# EAGLE design plc-bridge (EAGLE 9.6.2)
Powerline Bridge: mains-powered HomePlug Green PHY (QCA7005) ↔ 10/100 Ethernet bridge: PLC Stamp mini 2 + ESP32 SPI host + WIZ850io
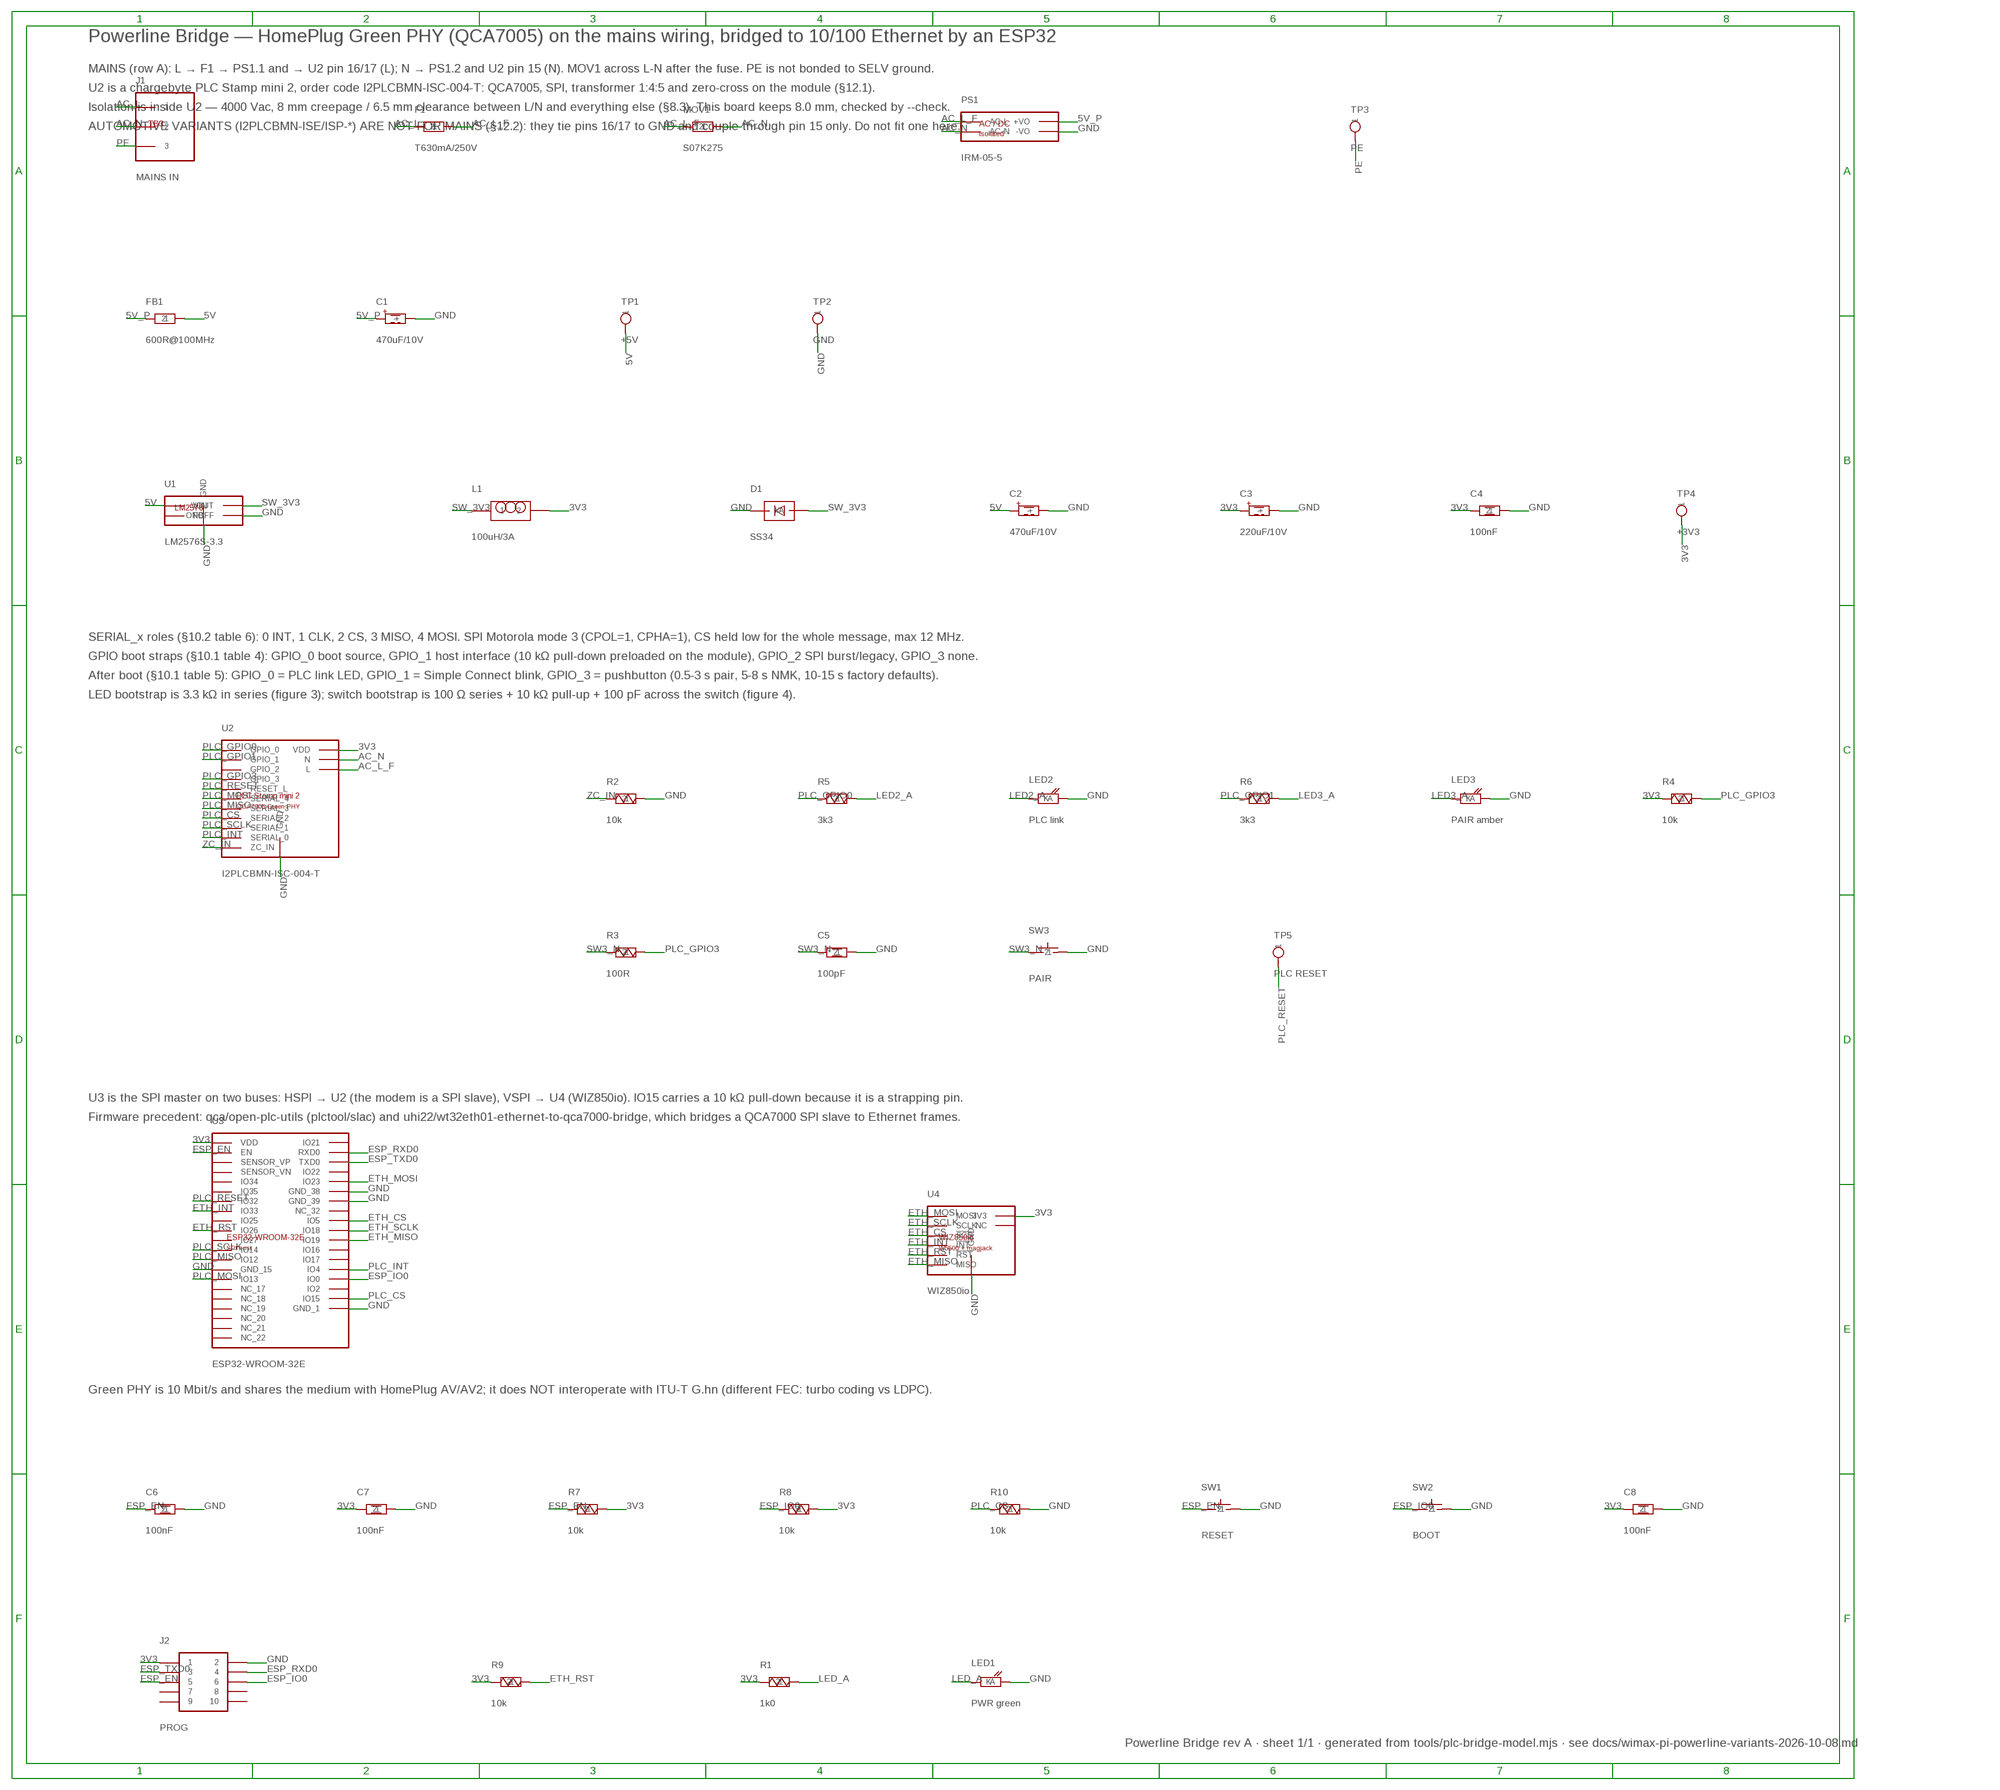
[diagram p0: schematic, sheet 1]

## Parts
C1  470uF/10V  CPOL-EU  [CP-D10-P5]
C2  470uF/10V  CPOL-EU  [CP-D10-P5]
C3  220uF/10V  CPOL-EU  [CP-D10-P5]
C4  100nF  C-0603  [C0603]
C5  100pF  C-EU  [C-5.08]
C6  100nF  C-0603  [C0603]
C7  100nF  C-0603  [C0603]
C8  100nF  C-0603  [C0603]
D1  SS34  DIODE-SCH  [DO41]
F1  T630mA/250V  FUSE  [FUSE-RADIAL]
FB1  600R@100MHz  FERRITE  [FB-7.62]
J1  MAINS IN  TERM-3  [CUI_TB003]
J2  PROG  HDR-2X5  [HDR-2X5]
L1  100uH/3A  L-RADIAL  [LRAD12]
LED1  PWR green  LED  [LED-5MM]
LED2  PLC link  LED  [LED-5MM]
LED3  PAIR amber  LED  [LED-5MM]
MOV1  S07K275  MOV  [MOV07]
PS1  IRM-05-5  ACDC-5V  [IRM055]
R1  1k0  R-EU  [R-7.62]
R2  10k  R-EU  [R-7.62]
R3  100R  R-EU  [R-7.62]
R4  10k  R-EU  [R-7.62]
R5  3k3  R-EU  [R-7.62]
R6  3k3  R-EU  [R-7.62]
R7  10k  R-EU  [R-7.62]
R8  10k  R-EU  [R-7.62]
R9  10k  R-EU  [R-7.62]
R10  10k  R-EU  [R-7.62]
SW1  RESET  SW-PUSH  [SW-TACT-6MM]
SW2  BOOT  SW-PUSH  [SW-TACT-6MM]
SW3  PAIR  SW-PUSH  [SW-TACT-6MM]
TP1  +5V  TP  [TP]
TP2  GND  TP  [TP]
TP3  PE  TP  [TP]
TP4  +3V3  TP  [TP]
TP5  PLC RESET  TP  [TP]
U1  LM2576S-3.3  BUCK-3V3  [LM2576S]
U2  I2PLCBMN-ISC-004-T  PLC-STAMP-MINI-2  [PLCSTAMP]
U3  ESP32-WROOM-32E  [ESP32WROOM]
U4  WIZ850io  WIZ850IO  [WIZ850IO]

## Nets
3V3 [power]: C3.+ C4.1 C7.1 C8.1 J2.1 L1.2 R1.1 R4.1 R7.2 R8.2 R9.1 TP4.1 U2.12(VDD) U3.2(VDD) U4.8(3V3) U4.9(3V3)
5V [power]: C2.+ FB1.2 TP1.1 U1.1(VIN)
5V_P [power]: C1.+ FB1.1 PS1.4(+VO)
AC_L [mains]: F1.1 J1.1
AC_L_F [mains]: F1.2 MOV1.1 PS1.1(AC-L) U2.16(L) U2.17(L)
AC_N [mains]: J1.2 MOV1.2 PS1.2(AC-N) U2.15(N)
ESP_EN: C6.1 J2.5 R7.1 SW1.1 U3.3(EN)
ESP_IO0: J2.6 R8.1 SW2.1 U3.25(IO0)
ESP_RXD0: J2.4 U3.34(RXD0)
ESP_TXD0: J2.3 U3.35(TXD0)
ETH_CS: U3.29(IO5) U4.5(!SCS)
ETH_INT: U3.9(IO33) U4.6(!INT)
ETH_MISO: U3.31(IO19) U4.12(MISO)
ETH_MOSI: U3.37(IO23) U4.3(MOSI)
ETH_RST: R9.2 U3.11(IO26) U4.11(!RST)
ETH_SCLK: U3.30(IO18) U4.4(SCLK)
GND [power]: C1.- C2.- C3.- C4.2 C5.2 C6.2 C7.2 C8.2 D1.A J2.2 LED1.2(K) LED2.2(K) LED3.2(K) PS1.3(-VO) R2.2 R10.2 SW1.2 SW2.2 SW3.2 TP2.1 U1.3(GND) U1.3_2(GND) U1.5(ONOFF) U1.P7(GND) U1.P8(GND) U1.P9(GND) U1.P10(GND) U2.11(GND) U2.18(GND) U2.19(GND) U2.20(GND) U2.21(GND) U2.22(GND) U2.23(GND) U2.24(GND) U2.25(GND) U3.1(GND_1) U3.15(GND_15) U3.38(GND_38) U3.39(GND_39) U4.1(GND) U4.2(GND) U4.7(GND)
LED2_A: LED2.1(A) R5.2
LED3_A: LED3.1(A) R6.2
LED_A: LED1.1(A) R1.2
PE [mains]: J1.3 TP3.1
PLC_CS: R10.1 U2.8(SERIAL_2) U3.23(IO15)
PLC_GPIO0: R5.1 U2.1(GPIO_0)
PLC_GPIO1: R6.1 U2.2(GPIO_1)
PLC_GPIO3: R3.2 R4.2 U2.4(GPIO_3)
PLC_INT: U2.10(SERIAL_0) U3.26(IO4)
PLC_MISO: U2.7(SERIAL_3) U3.14(IO12)
PLC_MOSI: U2.6(SERIAL_4) U3.16(IO13)
PLC_RESET: TP5.1 U2.5(RESET_L) U3.8(IO32)
PLC_SCLK: U2.9(SERIAL_1) U3.13(IO14)
SW3_N: C5.1 R3.1 SW3.1
SW_3V3 [power]: D1.K L1.1 U1.2(VOUT)
ZC_IN: R2.1 U2.13(ZC_IN)
Unconnected: J2.7 J2.8 J2.9 J2.10 U1.4(FB) U2.3(GPIO_2) U3.4(SENSOR_VP) U3.5(SENSOR_VN) U3.6(IO34) U3.7(IO35) U3.10(IO25) U3.12(IO27) U3.17(NC_17) U3.18(NC_18) U3.19(NC_19) U3.20(NC_20) U3.21(NC_21) U3.22(NC_22) U3.24(IO2) U3.27(IO16) U3.28(IO17) U3.32(NC_32) U3.33(IO21) U3.36(IO22) U4.10(NC)

## Notes on the sheet
- Powerline Bridge — HomePlug Green PHY (QCA7005) on the mains wiring, bridged to 10/100 Ethernet by an ESP32
- MAINS (row A): L → F1 → PS1.1 and → U2 pin 16/17 (L); N → PS1.2 and U2 pin 15 (N). MOV1 across L-N after the fuse. PE is not bonded to SELV ground.
- U2 is a chargebyte PLC Stamp mini 2, order code I2PLCBMN-ISC-004-T: QCA7005, SPI, transformer 1:4:5 and zero-cross on the module (§12.1).
- Isolation is inside U2 — 4000 Vac, 8 mm creepage / 6.5 mm clearance between L/N and everything else (§8.3). This board keeps 8.0 mm, checked by --check.
- AUTOMOTIVE VARIANTS (I2PLCBMN-ISE/ISP-*) ARE NOT FOR MAINS (§12.2): they tie pins 16/17 to GND and couple through pin 15 only. Do not fit one here.
- SERIAL_x roles (§10.2 table 6): 0 INT, 1 CLK, 2 CS, 3 MISO, 4 MOSI. SPI Motorola mode 3 (CPOL=1, CPHA=1), CS held low for the whole message, max 12 MHz.
- GPIO boot straps (§10.1 table 4): GPIO_0 boot source, GPIO_1 host interface (10 kΩ pull-down preloaded on the module), GPIO_2 SPI burst/legacy, GPIO_3 none.
- After boot (§10.1 table 5): GPIO_0 = PLC link LED, GPIO_1 = Simple Connect blink, GPIO_3 = pushbutton (0.5-3 s pair, 5-8 s NMK, 10-15 s factory defaults).
- LED bootstrap is 3.3 kΩ in series (figure 3); switch bootstrap is 100 Ω series + 10 kΩ pull-up + 100 pF across the switch (figure 4).
- U3 is the SPI master on two buses: HSPI → U2 (the modem is a SPI slave), VSPI → U4 (WIZ850io). IO15 carries a 10 kΩ pull-down because it is a strapping pin.
- Firmware precedent: qca/open-plc-utils (plctool/slac) and uhi22/wt32eth01-ethernet-to-qca7000-bridge, which bridges a QCA7000 SPI slave to Ethernet frames.
- Green PHY is 10 Mbit/s and shares the medium with HomePlug AV/AV2; it does NOT interoperate with ITU-T G.hn (different FEC: turbo coding vs LDPC).
- Powerline Bridge rev A · sheet 1/1 · generated from tools/plc-bridge-model.mjs · see docs/wimax-pi-powerline-variants-2026-10-08.md

## Library data of the parts
C1-C3 = plc-bridge:CPOL-EU
C4 C6-C8 = plc-bridge:C-0603
C5 = plc-bridge:C-EU
D1 = plc-bridge:DIODE-SCH
F1 = plc-bridge:FUSE
FB1 = plc-bridge:FERRITE
J1 = plc-bridge:TERM-3
J2 = plc-bridge:HDR-2X5
L1 = plc-bridge:L-RADIAL
LED1-LED3 = plc-bridge:LED
MOV1 = plc-bridge:MOV
PS1 = plc-bridge:ACDC-5V
R1-R10 = plc-bridge:R-EU
SW1-SW3 = plc-bridge:SW-PUSH
TP1-TP5 = plc-bridge:TP
U1 = plc-bridge:BUCK-3V3
U2 = plc-bridge:PLC-STAMP-MINI-2
U3 = plc-bridge:ESP32-WROOM-32E
U4 = plc-bridge:WIZ850IO

## Net classes
0 default: width 0.305 mm
1 mains: width 2.5 mm, clearance 8 mm to class 0, clearance 8 mm, clearance 8 mm to class 2
2 power: width 1 mm, clearance 0.5 mm to class 0, clearance 0.6 mm

## Board
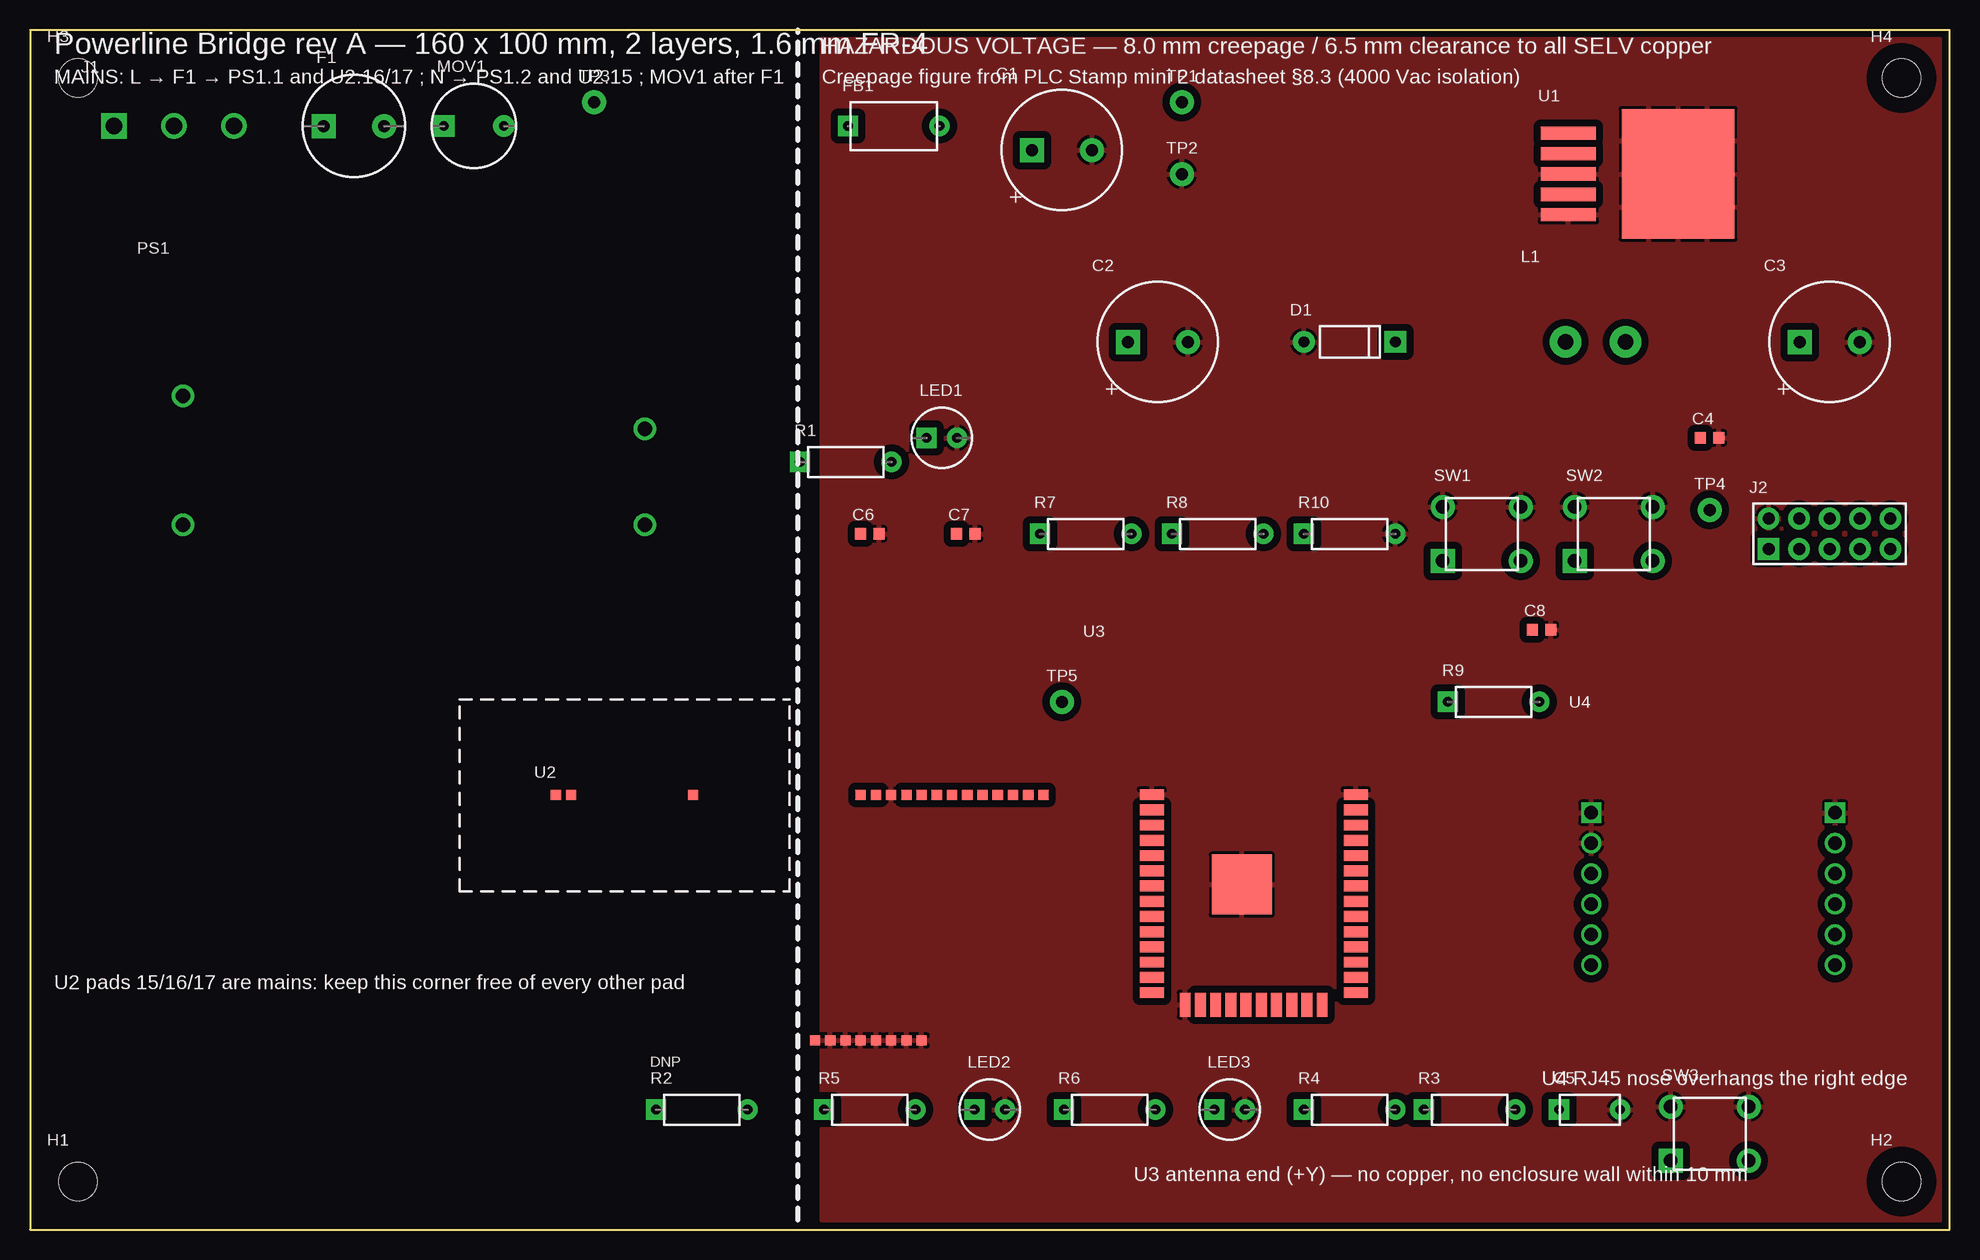
[diagram p1: board, top side]
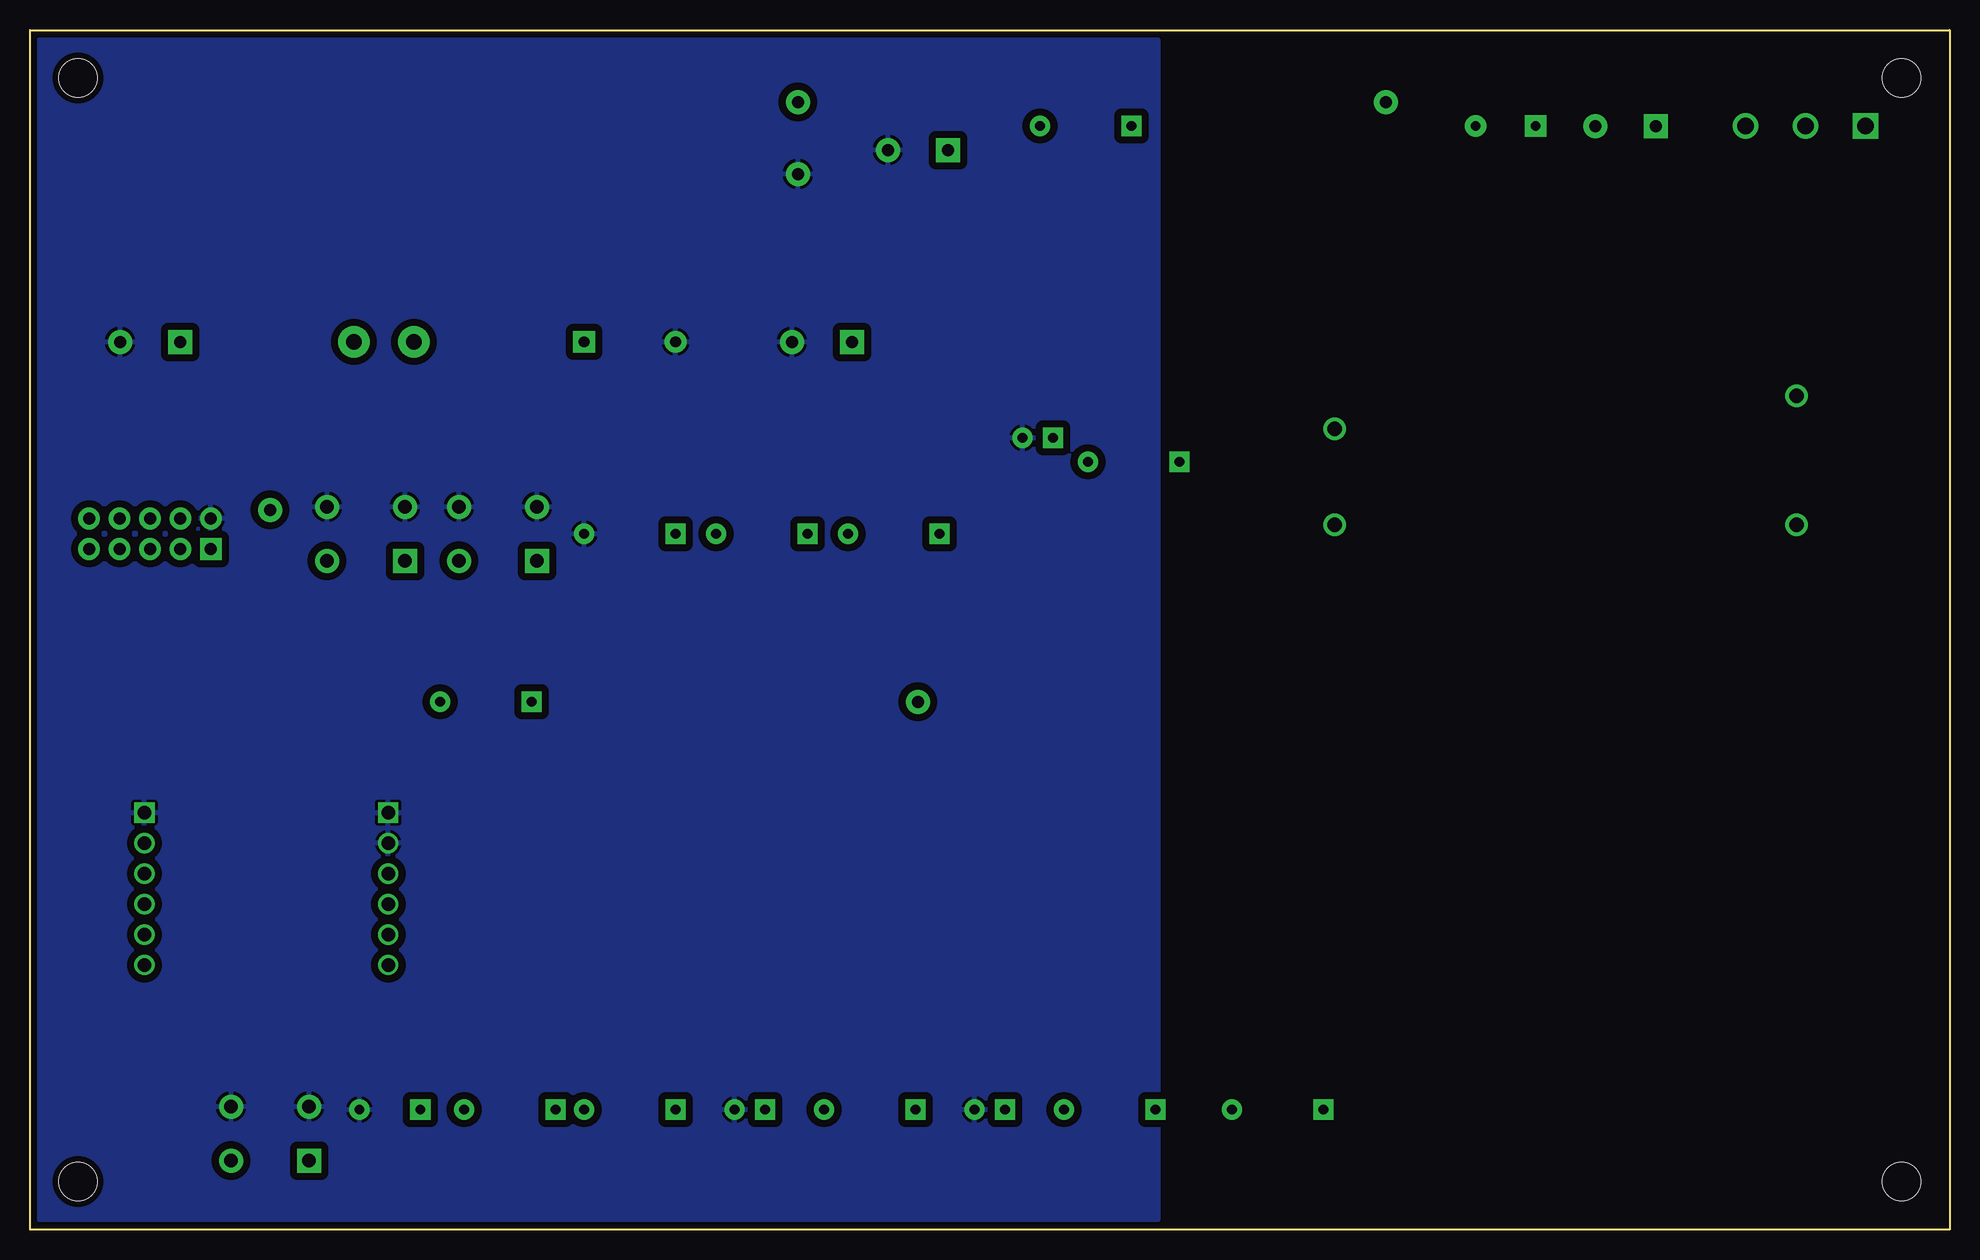
[diagram p2: board, bottom side, seen from below]

Size 160 x 100 mm. Coordinates in mm from the lower left corner, seen from the top.
Outline: 0,0 160,0 160,100 0,100 0,0
Copper layers (1*16): Top 0.035mm / dielectric 1.5mm / Bottom 0.035mm
Design rules "plc-bridge-2layer": minimum track width 8mil, minimum drill 0.35mm, track to track 8mil, track to pad 8mil, pad to pad 8mil, via to via 8mil, smd to smd 0mil, copper to edge 20mil, drill to drill 8mil, minimum pad ring 10mil, minimum via ring 8mil, stop-mask expansion 4mil, vias tented up to drill 25mil, thermal gap 10mil
tRestrict: 2 lines

### Footprints (pad centres in the part's own frame; a part is rotated, then mirrored left to right if it is on the bottom)
CP-D10-P5 = drill 1 pad 2 square: + -2.5,0 | drill 1 pad 2: - 2.5,0
C0603 = smd 0.9 x 0.95: 1 -0.775,0; 2 0.775,0
C-5.08 = drill 0.8 pad 1.7 square: 1 -2.54,0 | drill 0.8 pad 1.7: 2 2.54,0
DO41 = drill 0.9 pad 1.8: A -3.81,0 | drill 0.9 pad 1.8 square: K 3.81,0
FUSE-RADIAL = drill 1 pad 2 square: 1 -2.54,0 | drill 1 pad 2: 2 2.54,0
FB-7.62 = drill 0.8 pad 1.7 square: 1 -3.81,0 | drill 0.8 pad 1.7: 2 3.81,0
MOUNT-M3 = hole 3.2: 0,0
CUI_TB003 = drill 1.4 pad 2.1 square: 1 -5,0 | drill 1.4 pad 2.1: 2 0,0; 3 5,0
HDR-2X5 = drill 1 pad 1.8 square: 1 -5.08,-1.27 | drill 1 pad 1.8: 2 -5.08,1.27; 3 -2.54,-1.27; 4 -2.54,1.27; 5 0,-1.27; 6 0,1.27; 7 2.54,-1.27; 8 2.54,1.27; 9 5.08,-1.27; 10 5.08,1.27
LRAD12 = drill 1.3 pad 2.6: 1 0,0; 2 5,0
LED-5MM = drill 0.8 pad 1.7 square: 1 -1.27,0 | drill 0.8 pad 1.7: 2 1.27,0
MOV07 = drill 0.8 pad 1.8 square: 1 -2.5,0 | drill 0.8 pad 1.8: 2 2.5,0
IRM055 = drill 1.24 pad 1.86: 1 -19.25,-9.25; 2 -19.25,1.5; 3 19.25,-9.25; 4 19.25,-1.25
R-7.62 = drill 0.8 pad 1.7 square: 1 -3.81,0 | drill 0.8 pad 1.7: 2 3.81,0
SW-TACT-6MM = drill 1.1 pad 2 square: 1 -3.25,-2.25 | drill 1.1 pad 2: 1 3.25,-2.25; 2 -3.25,2.25; 2 3.25,2.25
TP = drill 1 pad 2: 1 0,0
LM2576S = smd 4.6 x 1.1: 1 -5.775,3.4; 2 -5.775,1.7; 3 -5.775,0; 4 -5.775,-1.7; 5 -5.775,-3.4 | smd 9.4 x 10.8: 3_2 3.375,0 | smd 4.55 x 5.25: P7 5.8,-2.775; P8 0.95,2.775; P9 5.8,2.775; P10 0.95,-2.775
PLCSTAMP = smd 0.85 x 0.85: 1 20.48,10.235; 2 19.21,10.235; 3 17.94,10.235; 4 16.67,10.235; 5 15.4,10.235; 6 14.13,10.235; 7 12.86,10.235; 8 11.59,10.235; 9 10.32,10.235; 10 9.05,10.235; 11 7.78,10.235; 12 6.51,10.235; 13 5.24,10.235; 15 -8.73,10.235; 16 -18.89,10.235; 17 -20.16,10.235; 18 1.43,-10.235; 19 2.7,-10.235; 20 3.97,-10.235; 21 5.24,-10.235; 22 6.51,-10.235; 23 7.78,-10.235; 24 9.05,-10.235; 25 10.32,-10.235
ESP32WROOM = smd 2 x 0.9: 1 -8.5,8.255; 2 -8.5,6.985; 3 -8.5,5.715; 4 -8.5,4.445; 5 -8.5,3.175; 6 -8.5,1.905; 7 -8.5,0.635; 8 -8.5,-0.635; 9 -8.5,-1.905; 10 -8.5,-3.175; 11 -8.5,-4.445; 12 -8.5,-5.715; 13 -8.5,-6.985; 14 -8.5,-8.255; 25 8.5,-8.255; 26 8.5,-6.985; 27 8.5,-5.715; 28 8.5,-4.445; 29 8.5,-3.175; 30 8.5,-1.905; 31 8.5,-0.635; 32 8.5,0.635; 33 8.5,1.905; 34 8.5,3.175; 35 8.5,4.445; 36 8.5,5.715; 37 8.5,6.985; 38 8.5,8.255 | smd 0.9 x 2: 15 -5.715,-9.255; 16 -4.445,-9.255; 17 -3.175,-9.255; 18 -1.905,-9.255; 19 -0.635,-9.255; 20 0.635,-9.255; 21 1.905,-9.255; 22 3.175,-9.255; 23 4.445,-9.255; 24 5.715,-9.255 | smd 5 x 5: 39 -1,0.755
WIZ850IO = drill 1.12 pad 1.68 square: 1 -9.86,4.75; 7 10.46,4.75 | drill 1.12 pad 1.68: 2 -9.86,2.21; 3 -9.86,-0.33; 4 -9.86,-2.87; 5 -9.86,-5.41; 6 -9.86,-7.95; 8 10.46,2.21; 9 10.46,-0.33; 10 10.46,-2.87; 11 10.46,-5.41; 12 10.46,-7.95

### Placement (x,y rotation side)
C1  86,90 0 top
C2  94,74 0 top
C3  150,74 0 top
C4  140,66 0 top
C5  130,10 0 top
C6  70,58 0 top
C7  78,58 0 top
C8  126,50 0 top
D1  110,74 0 top
F1  27,92 0 top
FB1  72,92 0 top
H1  [MOUNT-M3]  4,4 0 top
H2  [MOUNT-M3]  156,4 0 top
H3  [MOUNT-M3]  4,96 0 top
H4  [MOUNT-M3]  156,96 0 top
J1  12,92 0 top
J2  150,58 0 top
L1  128,74 0 top
LED1  76,66 0 top
LED2  80,10 0 top
LED3  100,10 0 top
MOV1  37,92 0 top
PS1  32,68 0 top
R1  68,64 0 top
R2  56,10 0 top
R3  120,10 0 top
R4  110,10 0 top
R5  70,10 0 top
R6  90,10 0 top
R7  88,58 0 top
R8  99,58 0 top
R9  122,44 0 top
R10  110,58 0 top
SW1  121,58 0 top
SW2  132,58 0 top
SW3  140,8 0 top
TP1  96,94 0 top
TP2  96,88 0 top
TP3  47,94 0 top
TP4  140,60 0 top
TP5  86,44 0 top
U1  134,88 0 top
U2  64,26 0 top
U3  102,28 0 top
U4  140,30 0 top

### Tracks (layer width: path | path; a pad name or v marks a point on that pad's centre or on a via)
GND
  pour Top (isolate 0.4, rank 2): 66,0.8 159.2,0.8 159.2,99.2 66,99.2
  pour Bottom (isolate 0.4, rank 2): 66,0.8 159.2,0.8 159.2,99.2 66,99.2

### Text on the board
tPlace: Powerline Bridge rev A — 160 x 100 mm, 2 layers, 1.6 mm FR-4 | HAZARDOUS VOLTAGE — 8.0 mm creepage / 6.5 mm clearance to all SELV copper | MAINS: L → F1 → PS1.1 and U2.16/17 ; N → PS1.2 and U2.15 ; MOV1 after F1 | Creepage figure from PLC Stamp mini 2 datasheet §8.3 (4000 Vac isolation) | U2 pads 15/16/17 are mains: keep this corner free of every other pad | U4 RJ45 nose overhangs the right edge | U3 antenna end (+Y) — no copper, no enclosure wall within 10 mm